# Altium schematic sheet Siren_Board.SchDoc
size B
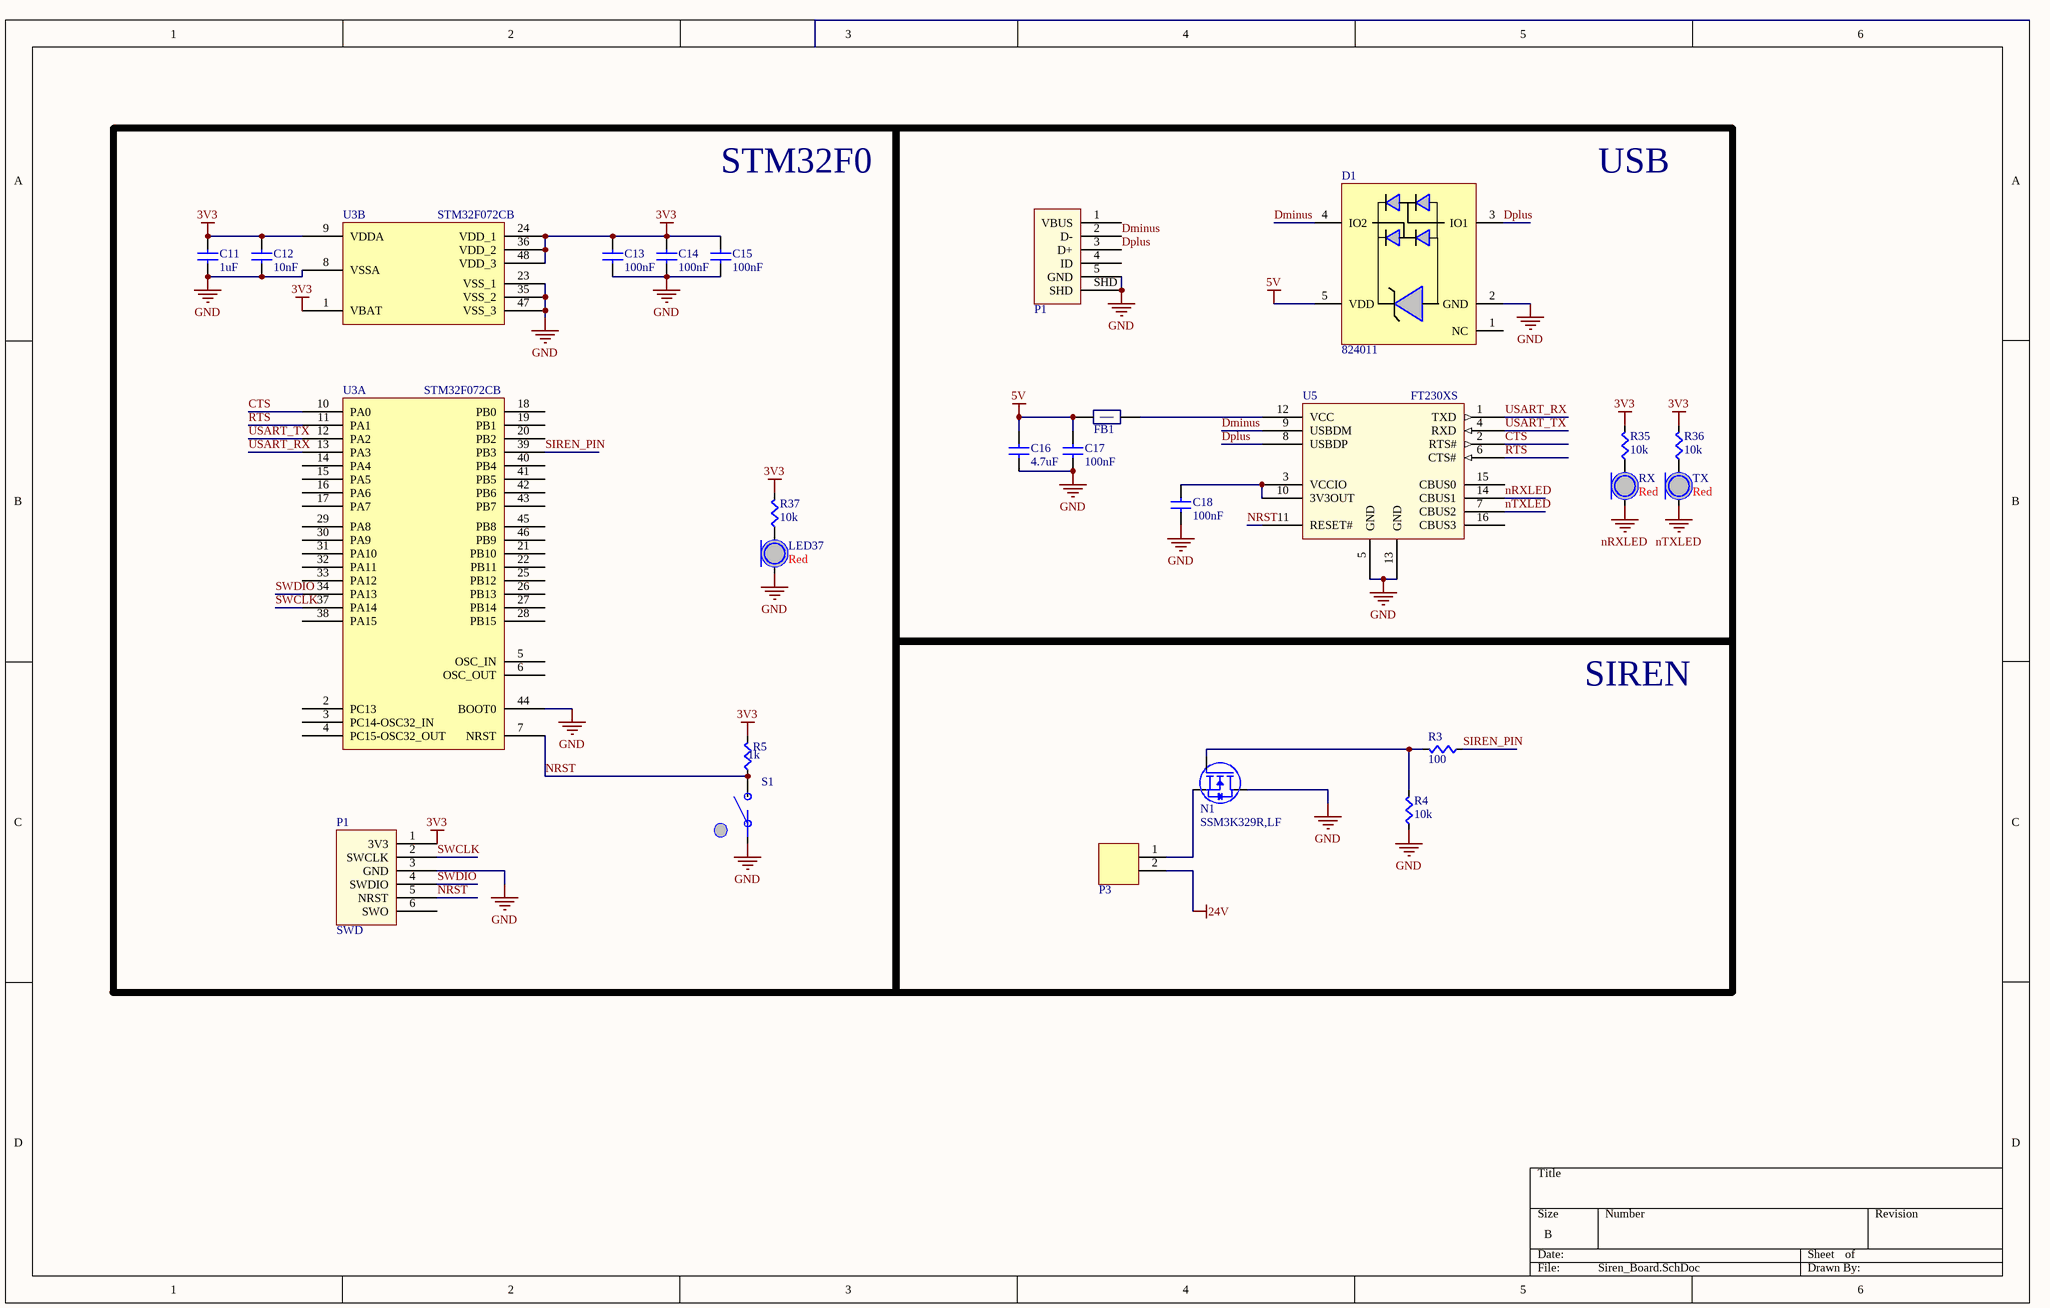
[diagram p0: Siren_Board.SchDoc]

## Parts
(Parts that share a designator on the sheet are numbered #1, #2 ... from top to bottom, then left to right.)
C11  value 1uF  [CAPC0603]  (hidden comment: Cap)
C12  value 10nF  [CAPC0603]  (hidden comment: Cap)
C13  value 100nF  [CAPC0603]  (hidden comment: Cap)
C14  value 100nF  [CAPC0603]  (hidden comment: Cap)
C15  value 100nF  [CAPC0603]  (hidden comment: Cap)
C16  value 4.7uF  [CAPC0603]  (hidden comment: Cap)
C17  value 100nF  [CAPC0603]  (hidden comment: Cap)
C18  value 100nF  [CAPC0603]  (hidden comment: Cap)
D1  824011  [SOT95P280X116-5N]
FB1  FBead  [RES0603]  (value not drawn)
LED37  Color: Red  [LED0603]  (hidden comment: LED)
N1  SSM3K329R,LF  [SSM3K329R,LF]
P1#1  UX60SC-MB-5ST  [UX60SC-MB-5ST]  (value not drawn)
P1#2  SWD  [SWD_STM32]
P3  2-pin Horz Sherlock  [MOLEX-HDR-1X2-SHERLOCK-HORZ]  (value not drawn)
R3  value 100  [RES0603]  (hidden comment: Res)
R4  value 10k  [RES0603]  (hidden comment: Res)
R5  value 1k  [RES0603]  (hidden comment: Res)
R35  value 10k  [RES0603]  (hidden comment: Res)
R36  value 10k  [RES0603]  (hidden comment: Res)
R37  value 10k  [RES0603]  (hidden comment: Res)
RX  Color: Red  [LED0603]  (hidden comment: LED)
S1  Button  [PTS645xxxxSMTR92]  (value not drawn)
TX  Color: Red  [LED0603]  (hidden comment: LED)
U3  STM32F072CB  [STM32F072CB]  (parts A,B of 2)
U5  FT230XS  [FT230XS]

## Blocks framed on the sheet
STM32F0: C11-C15 LED37 P1#2 R5 R37 S1 U3
USB: C16-C18 D1 FB1 P1#1 R35 R36 RX TX U5
SIREN: N1 P3 R3 R4

## Nets
3V3: C11.1(A) C12.1(A) C13.1(A) C14.1(A) C15.1(A) P1#2.1(3V3) R5.1(A) R35.1(A) R36.1(A) R37.1(A) U3.1(VBAT) U3.9(VDDA) U3.24(VDD_1) U3.36(VDD_2) U3.48(VDD_3)
5V: C16.1(A) C17.1(A) D1.5(VDD) FB1.1(A)
24V: P3.2
GND: C11.2(B) C12.2(B) C13.2(B) C14.2(B) C15.2(B) C16.2(B) C17.2(B) C18.2(B) D1.2(GND) LED37.C N1.3(D) P1#1.5(GND) P1#1.SHD P1#2.3(GND) R4.2(B) S1.A U3.8(VSSA) U3.23(VSS_1) U3.35(VSS_2) U3.44(BOOT0) U3.47(VSS_3) U5.5(GND) U5.13(GND)
nRXLED: RX.C U5.14(CBUS1)
nTXLED: TX.C U5.7(CBUS2)
CTS: U3.10(PA0) U5.2(RTS#)
Dminus: D1.4(IO2) P1#1.2(D-) U5.9(USBDM)
Dplus: D1.3(IO1) P1#1.3(D+) U5.8(USBDP)
NRST: P1#2.5(NRST) R5.2(B) S1.B U3.7(NRST) U5.11(RESET#)
RTS: U3.11(PA1) U5.6(CTS#)
SIREN_PIN: R3.1(A) U3.39(PB3)
SWCLK: P1#2.2(SWCLK) U3.37(PA14)
SWDIO: P1#2.4(SWDIO) U3.34(PA13)
USART_RX: U3.13(PA3) U5.1(TXD)
USART_TX: U3.12(PA2) U5.4(RXD)
NetC18_1: C18.1(A) U5.3(VCCIO) U5.10(3V3OUT)
NetFB1_2: FB1.2(B) U5.12(VCC)
NetLED37_A: LED37.A R37.2(B)
NetN1_1: N1.1(G) R3.2(B) R4.1(A)
NetN1_2: N1.2(S) P3.1
NetR35_2: R35.2(B) RX.A
NetR36_2: R36.2(B) TX.A

Not connected (* = marked no-connect by the designer): D1 1(NC); P1#1 1(VBUS) 4(ID); P1#2 6(SWO); U3 2(PC13) 3(PC14-OSC32_IN) 4(PC15-OSC32_OUT) 5(OSC_IN) 6(OSC_OUT) 14(PA4) 15(PA5) 16(PA6) 17(PA7) 18(PB0) 19(PB1) 20(PB2) 21(PB10) 22(PB11) 25(PB12) 26(PB13) 27(PB14) 28(PB15) 29(PA8) 30(PA9) 31(PA10) 32(PA11) 33(PA12) 38(PA15) 40(PB4) 41(PB5) 42(PB6) 43(PB7) 45(PB8) 46(PB9); U5 15(CBUS0) 16(CBUS3)

## Library data of the parts
D1 = 824011: USB ESD Protection Diodes
FB1 = FBead: Ferrite Bead; Supplier 1: Digi-Key; Supplier Part Number 1: 445-2988-1-ND
N1 = SSM3K329R,LF: MOSFET N CH 30V 3.5A 2-3Z1A; Manufacturer 1: Toshiba Semiconductor and Storage; Supplier 1: Digi-Key; Supplier Part Number 1: SSM3K329RLFTR-ND; Manufacturer Part Number 1: SSM3K329R,LF
P1#1 = UX60SC-MB-5ST: USB Mini B Metal Shield SMT; Supplier 1: Digi-Key; Supplier Part Number 1: H11671CT-ND
P1#2 = SWD_STM32: SWD connector matching the pinout on STM Discovery Boards
P3 = MOLEX-HDR-1x2-SHERLOCK_RA: Header, Molex, 2mm Pitch Sherlock Header, Single Row, Horizontal, 2 Circuits, Length 3.3mm,  0353630260; Manufacturer: Molex Inc; Manufacturer Part Number: 0353630260; Supplier Part Number 1: WM18931-ND; Supplier 1: Digi-Key
S1 = Button: SPST Button; Supplier 1: Digi-Key; Supplier Part Number 1: CKN9087CT-ND
U3 = STM32F072CB: MCU 32BIT 128KB FLASH 48LQFP; Supplier 1: Digi-Key; Supplier Part Number 1: 497-14645-ND
U5 = FT230XS: USB To Basic UART IC; Supplier 1: Digi-Key; Supplier Part Number 1: 768-1154-5-ND
C11-C18 = Cap: Supplier 1: Digi-Key
  C13-C15 C17 C18: Supplier Part Number 1: 1276-1000-1-ND
  C16: Supplier Part Number 1: 311-1455-1-ND
LED37 RX TX = LED: Supplier 1: Digi-Key; Supplier Part Number 1: 754-1122-1-ND
R3-R5 R35-R37 = Res: Supplier 1: Digi-Key
  R3: Supplier Part Number 1: 311-100LRDKR-ND
  R4 R35-R37: Supplier Part Number 1: RMCF0603JT10K0CT-ND